# Altium schematic sheet S7CAS-PLEIADES-CARTE-MERE_P06_ADC.SchDoc
size Tabloid; SheetNumber: 16; SheetTotal: 18; Sheet_Name: ADC; Size: 11x17
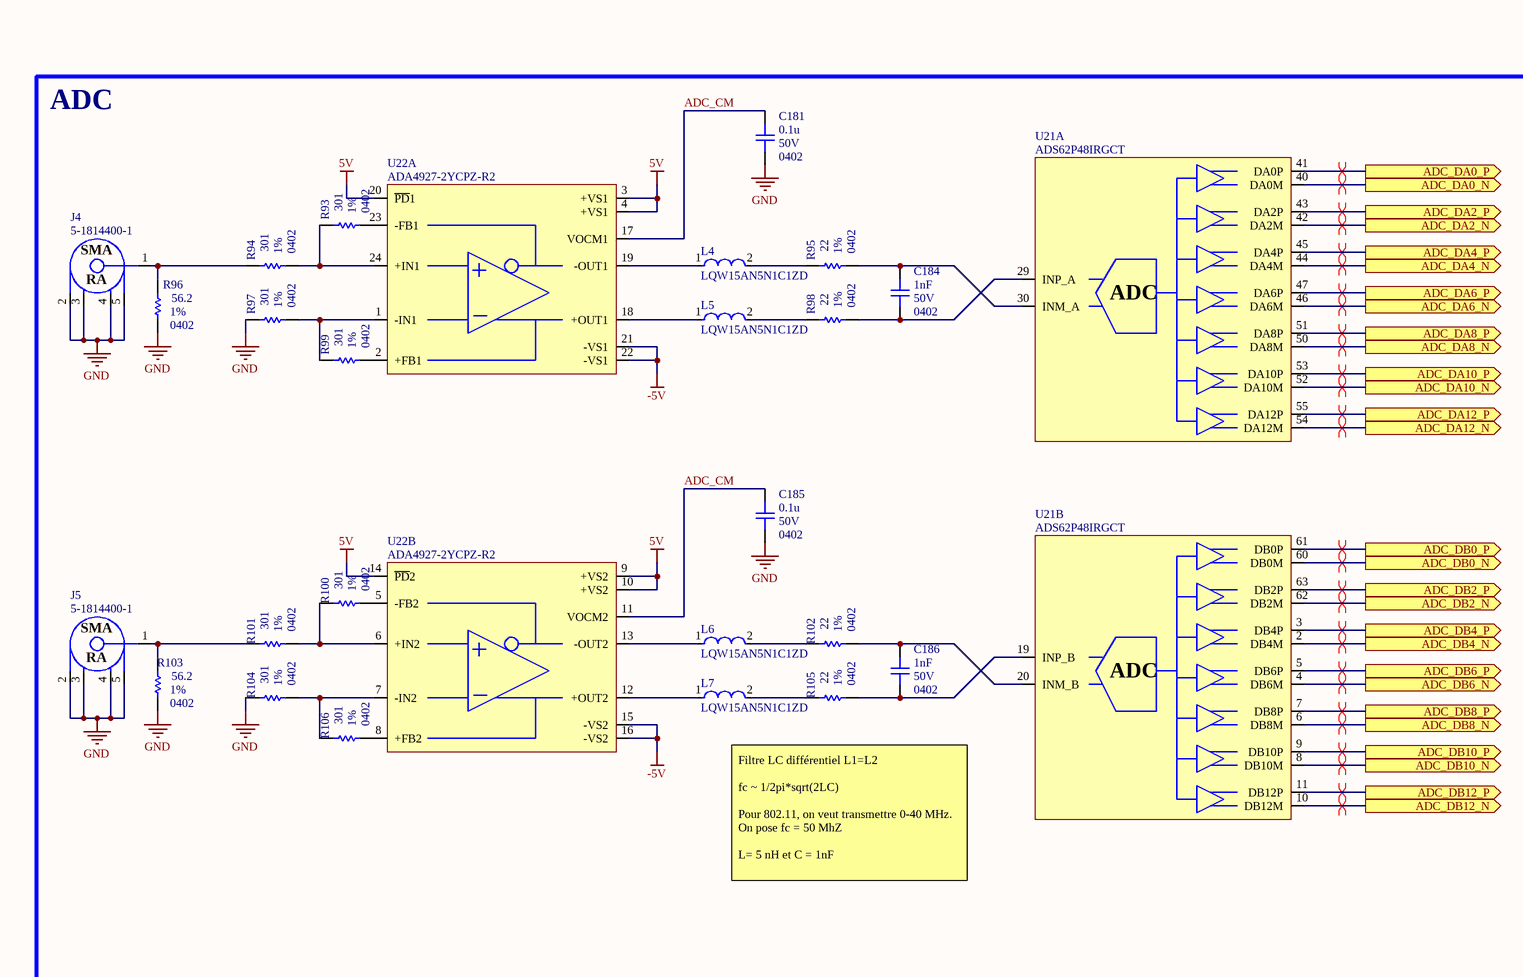
[diagram p0: S7CAS-PLEIADES-CARTE-MERE_P06_ADC.SchDoc, top left]
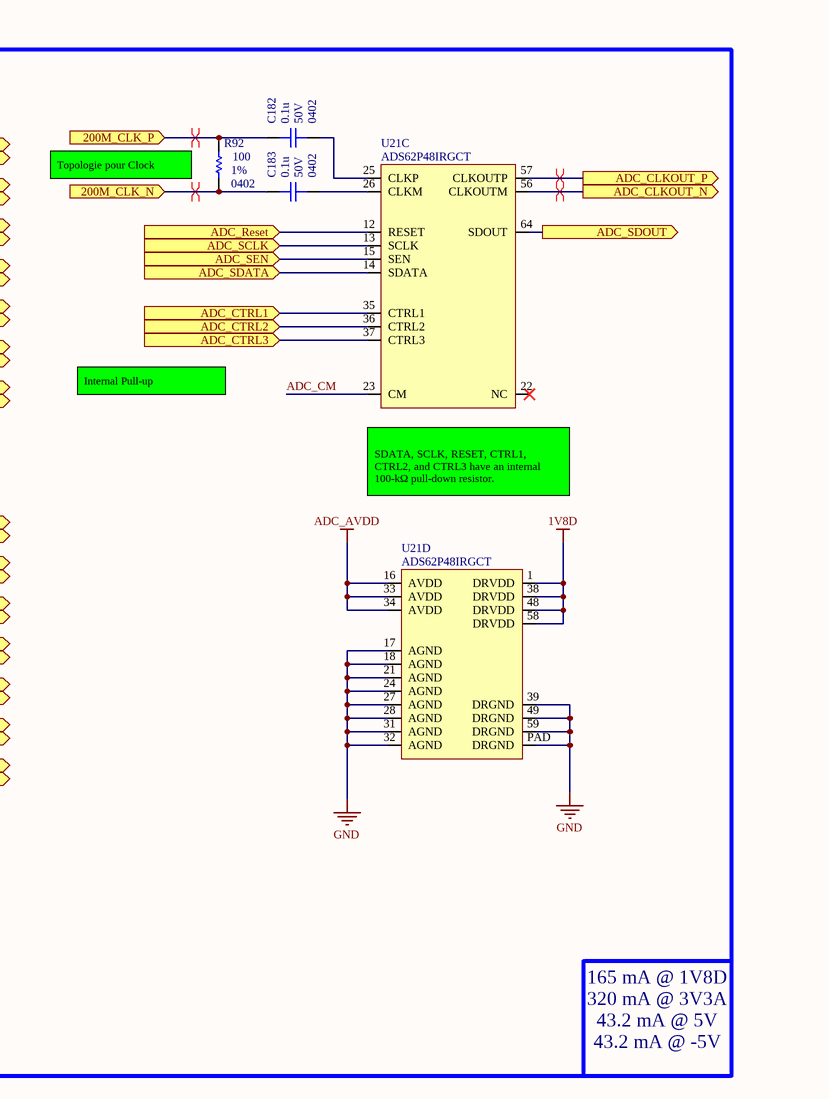
[diagram p1: S7CAS-PLEIADES-CARTE-MERE_P06_ADC.SchDoc, top middle]
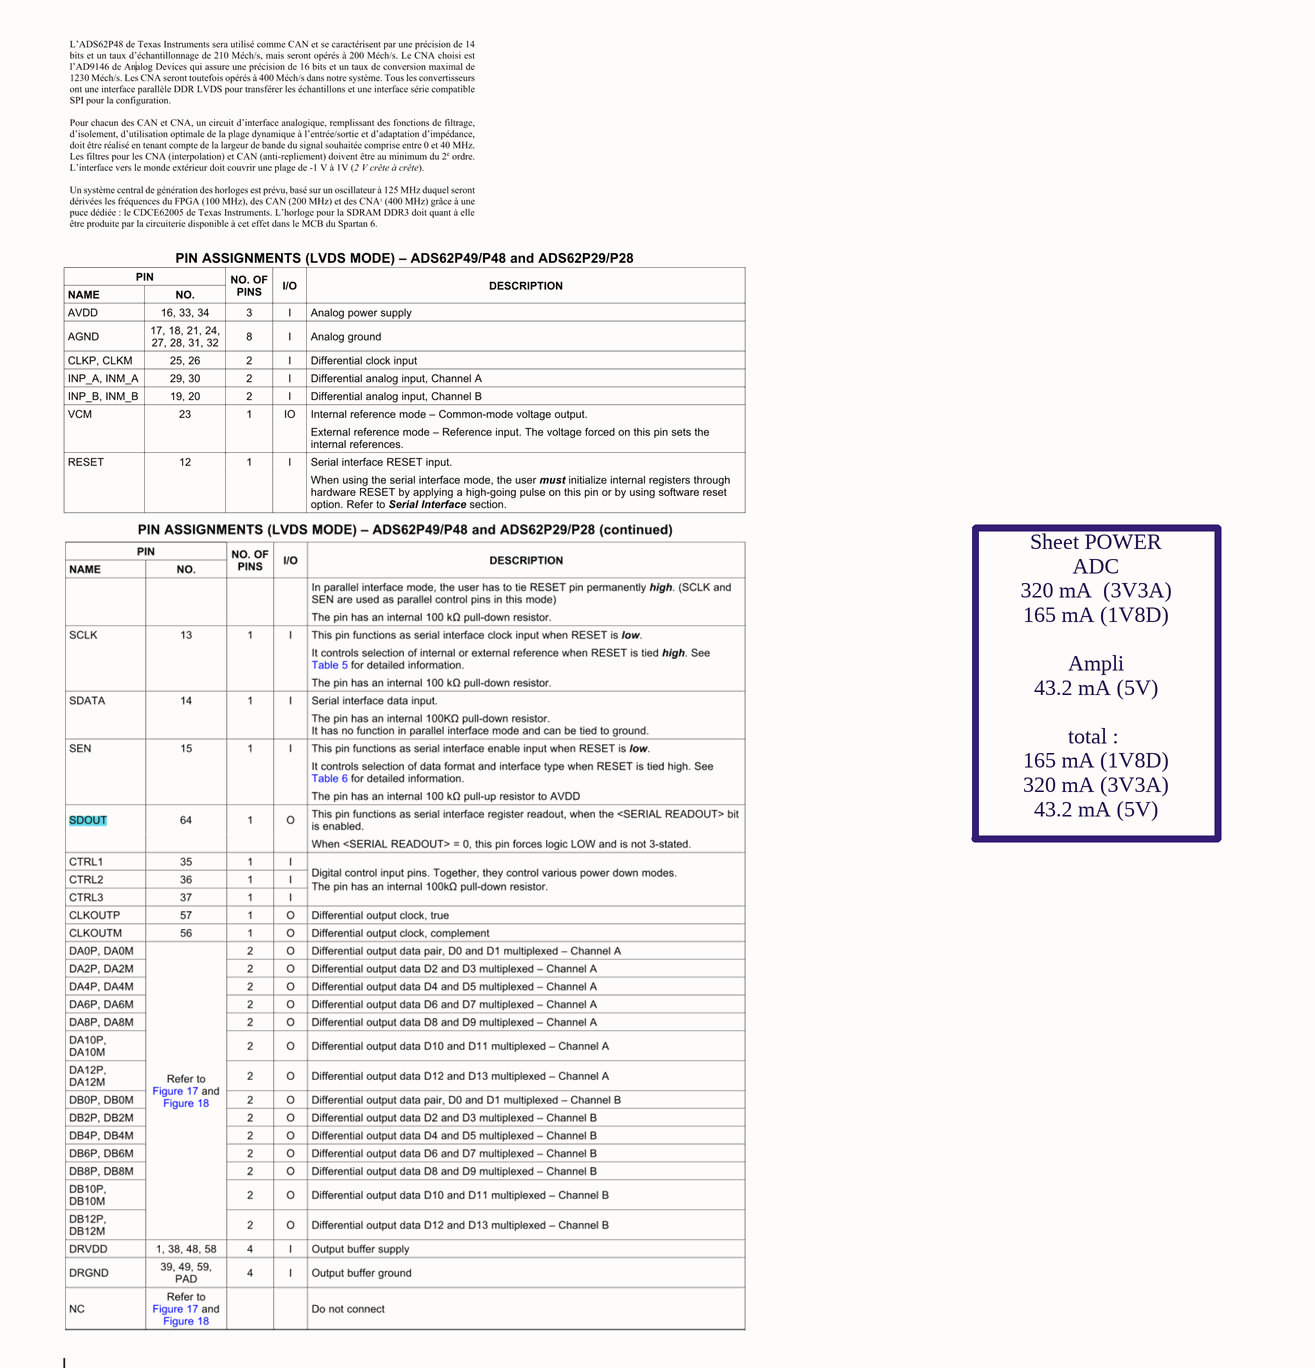
[diagram p2: S7CAS-PLEIADES-CARTE-MERE_P06_ADC.SchDoc, top right]
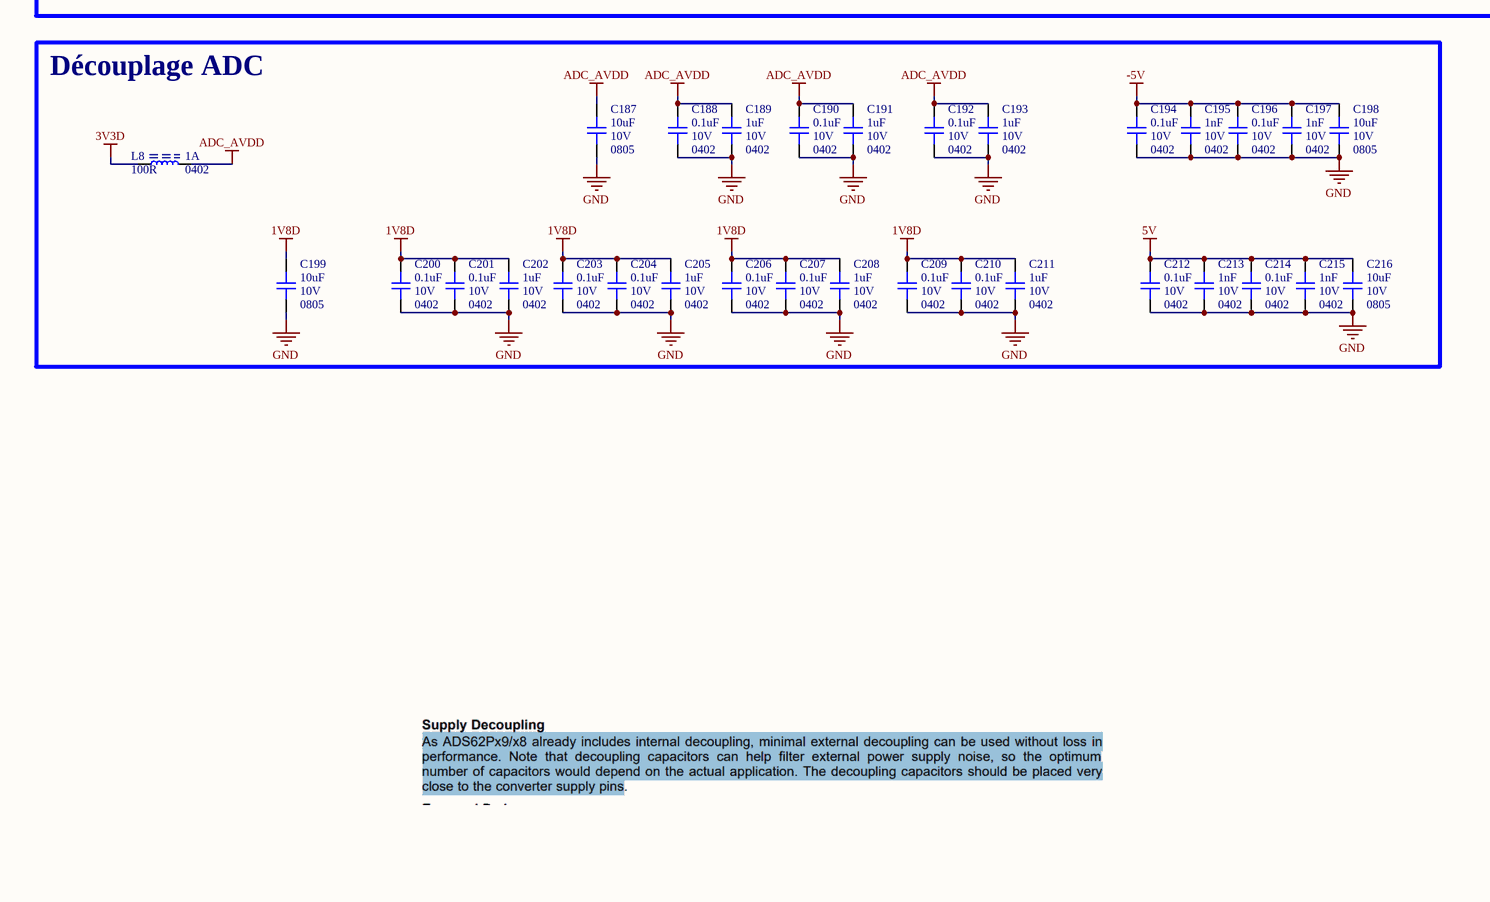
[diagram p3: S7CAS-PLEIADES-CARTE-MERE_P06_ADC.SchDoc, bottom left]
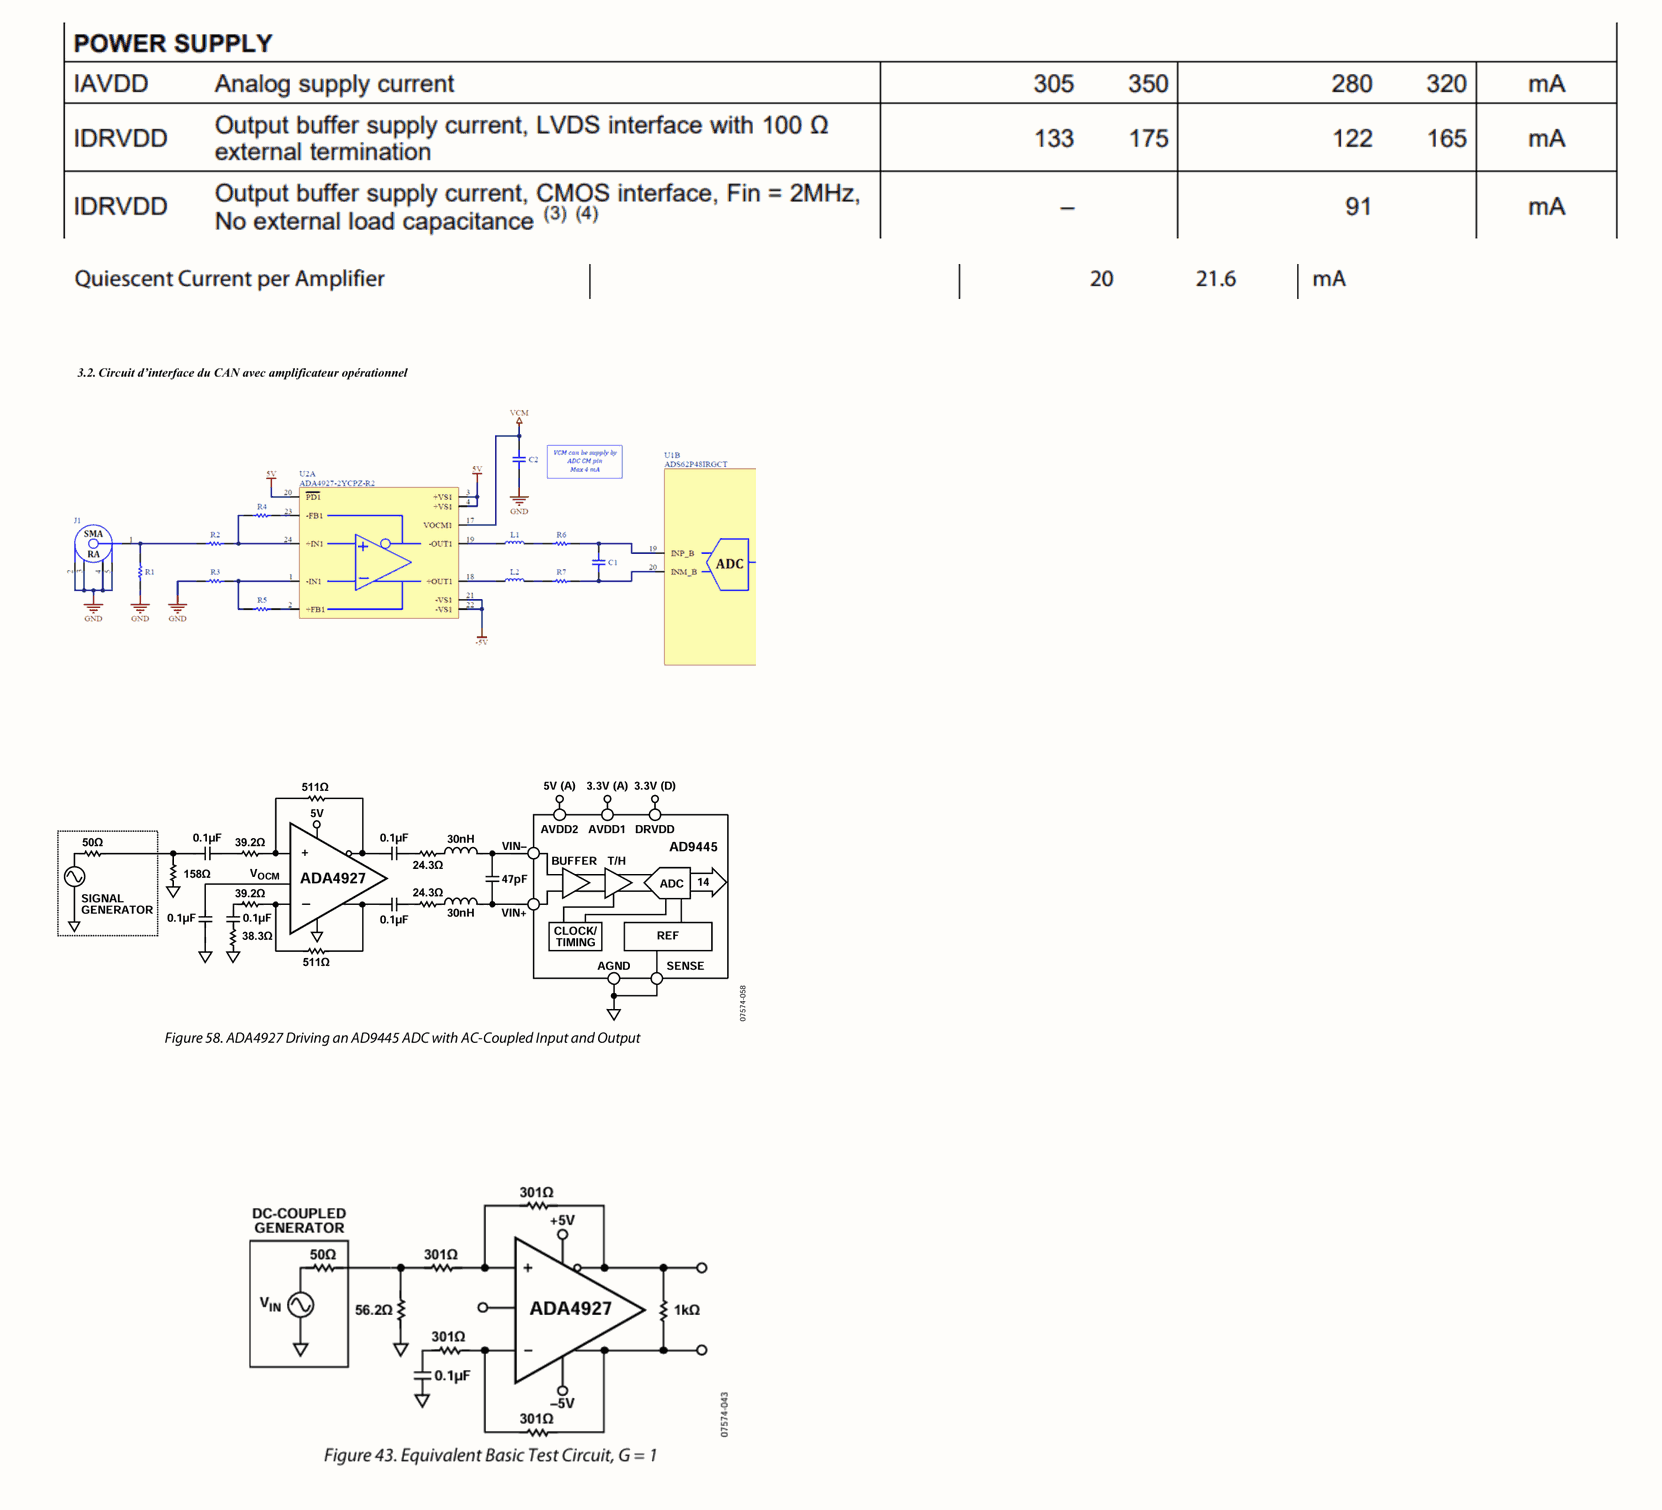
[diagram p4: S7CAS-PLEIADES-CARTE-MERE_P06_ADC.SchDoc, bottom right]

## Parts
C181  value 0.1u  Voltage: 50V  Package: 0402  [CAP_0402]  (hidden comment: CAP - 0402)
C182  value 0.1u  Voltage: 50V  Package: 0402  [CAP_0402]  (hidden comment: CAP - 0402)
C183  value 0.1u  Voltage: 50V  Package: 0402  [CAP_0402]  (hidden comment: CAP - 0402)
C184  value 1nF  Voltage: 50V  Package: 0402  [CAP_0402]  (hidden comment: CAP - 0402)
C185  value 0.1u  Voltage: 50V  Package: 0402  [CAP_0402]  (hidden comment: CAP - 0402)
C186  value 1nF  Voltage: 50V  Package: 0402  [CAP_0402]  (hidden comment: CAP - 0402)
C187  value 10uF  Voltage: 10V  Package: 0805  [CAP_0805]  (hidden comment: CAP - 0805)
C188  value 0.1uF  Voltage: 10V  Package: 0402  [CAP_0402]  (hidden comment: CAP - 0402)
C189  value 1uF  Voltage: 10V  Package: 0402  [CAP_0402]  (hidden comment: CAP - 0402)
C190  value 0.1uF  Voltage: 10V  Package: 0402  [CAP_0402]  (hidden comment: CAP - 0402)
C191  value 1uF  Voltage: 10V  Package: 0402  [CAP_0402]  (hidden comment: CAP - 0402)
C192  value 0.1uF  Voltage: 10V  Package: 0402  [CAP_0402]  (hidden comment: CAP - 0402)
C193  value 1uF  Voltage: 10V  Package: 0402  [CAP_0402]  (hidden comment: CAP - 0402)
C194  value 0.1uF  Voltage: 10V  Package: 0402  [CAP_0402]  (hidden comment: CAP - 0402)
C195  value 1nF  Voltage: 10V  Package: 0402  [CAP_0402]  (hidden comment: CAP - 0402)
C196  value 0.1uF  Voltage: 10V  Package: 0402  [CAP_0402]  (hidden comment: CAP - 0402)
C197  value 1nF  Voltage: 10V  Package: 0402  [CAP_0402]  (hidden comment: CAP - 0402)
C198  value 10uF  Voltage: 10V  Package: 0805  [CAP_0805]  (hidden comment: CAP - 0805)
C199  value 10uF  Voltage: 10V  Package: 0805  [CAP_0805]  (hidden comment: CAP - 0805)
C200  value 0.1uF  Voltage: 10V  Package: 0402  [CAP_0402]  (hidden comment: CAP - 0402)
C201  value 0.1uF  Voltage: 10V  Package: 0402  [CAP_0402]  (hidden comment: CAP - 0402)
C202  value 1uF  Voltage: 10V  Package: 0402  [CAP_0402]  (hidden comment: CAP - 0402)
C203  value 0.1uF  Voltage: 10V  Package: 0402  [CAP_0402]  (hidden comment: CAP - 0402)
C204  value 0.1uF  Voltage: 10V  Package: 0402  [CAP_0402]  (hidden comment: CAP - 0402)
C205  value 1uF  Voltage: 10V  Package: 0402  [CAP_0402]  (hidden comment: CAP - 0402)
C206  value 0.1uF  Voltage: 10V  Package: 0402  [CAP_0402]  (hidden comment: CAP - 0402)
C207  value 0.1uF  Voltage: 10V  Package: 0402  [CAP_0402]  (hidden comment: CAP - 0402)
C208  value 1uF  Voltage: 10V  Package: 0402  [CAP_0402]  (hidden comment: CAP - 0402)
C209  value 0.1uF  Voltage: 10V  Package: 0402  [CAP_0402]  (hidden comment: CAP - 0402)
C210  value 0.1uF  Voltage: 10V  Package: 0402  [CAP_0402]  (hidden comment: CAP - 0402)
C211  value 1uF  Voltage: 10V  Package: 0402  [CAP_0402]  (hidden comment: CAP - 0402)
C212  value 0.1uF  Voltage: 10V  Package: 0402  [CAP_0402]  (hidden comment: CAP - 0402)
C213  value 1nF  Voltage: 10V  Package: 0402  [CAP_0402]  (hidden comment: CAP - 0402)
C214  value 0.1uF  Voltage: 10V  Package: 0402  [CAP_0402]  (hidden comment: CAP - 0402)
C215  value 1nF  Voltage: 10V  Package: 0402  [CAP_0402]  (hidden comment: CAP - 0402)
C216  value 10uF  Voltage: 10V  Package: 0805  [CAP_0805]  (hidden comment: CAP - 0805)
J4  5-1814400-1  [CONN_SMA_5-1814400-1]
J5  5-1814400-1  [CONN_SMA_5-1814400-1]
L4  LQW15AN5N1C1ZD  [FP-LQW15AN_00-W0_6-0_1-MFG]
L5  LQW15AN5N1C1ZD  [FP-LQW15AN_00-W0_6-0_1-MFG]
L6  LQW15AN5N1C1ZD  [FP-LQW15AN_00-W0_6-0_1-MFG]
L7  LQW15AN5N1C1ZD  [FP-LQW15AN_00-W0_6-0_1-MFG]
L8  value 100R  Current: 1A  Package: 0402  [FER_0402]  (hidden comment: FER - 0402)
R92  value 100  Package: 0402  Precision: 1%  [RES_0402]  (hidden comment: RES - 0402)
R93  value 301  Package: 0402  Precision: 1%  [RES_0402]  (hidden comment: RES - 0402)
R94  value 301  Package: 0402  Precision: 1%  [RES_0402]  (hidden comment: RES - 0402)
R95  value 22  Package: 0402  Precision: 1%  [RES_0402]  (hidden comment: RES - 0402)
R96  value 56.2  Package: 0402  Precision: 1%  [RES_0402]  (hidden comment: RES - 0402)
R97  value 301  Package: 0402  Precision: 1%  [RES_0402]  (hidden comment: RES - 0402)
R98  value 22  Package: 0402  Precision: 1%  [RES_0402]  (hidden comment: RES - 0402)
R99  value 301  Package: 0402  Precision: 1%  [RES_0402]  (hidden comment: RES - 0402)
R100  value 301  Package: 0402  Precision: 1%  [RES_0402]  (hidden comment: RES - 0402)
R101  value 301  Package: 0402  Precision: 1%  [RES_0402]  (hidden comment: RES - 0402)
R102  value 22  Package: 0402  Precision: 1%  [RES_0402]  (hidden comment: RES - 0402)
R103  value 56.2  Package: 0402  Precision: 1%  [RES_0402]  (hidden comment: RES - 0402)
R104  value 301  Package: 0402  Precision: 1%  [RES_0402]  (hidden comment: RES - 0402)
R105  value 22  Package: 0402  Precision: 1%  [RES_0402]  (hidden comment: RES - 0402)
R106  value 301  Package: 0402  Precision: 1%  [RES_0402]  (hidden comment: RES - 0402)
U21  ADS62P48IRGCT  [ADC_ADS62P48IRGCT]  (parts A,B,C,D of 4)
U22  ADA4927-2YCPZ-R2  [OPAMP_ADA4927-2YCPZ-R2]  (parts A,B of 2)

## Blocks framed on the sheet
ADC: C181-C186 J4 J5 L4-L7 R92-R106 U21 U22
Découplage ADC: C187-C216 L8

## Ports
200M_CLK_N (in, see S7CAS-PLEIADES-CARTE-MERE_P06_CLOCK[4A]), 200M_CLK_P (in, see S7CAS-PLEIADES-CARTE-MERE_P06_CLOCK[4A]), ADC_CLKOUT_N (out, see S7CAS-PLEIADES-CARTE-MERE_P06_FPGA1[4B]), ADC_CLKOUT_P (out, see S7CAS-PLEIADES-CARTE-MERE_P06_FPGA1[4B]), ADC_CTRL1 (in, see S7CAS-PLEIADES-CARTE-MERE_P06_FPGA3[4B]), ADC_CTRL2 (in, see S7CAS-PLEIADES-CARTE-MERE_P06_FPGA3[4B]), ADC_CTRL3 (in, see S7CAS-PLEIADES-CARTE-MERE_P06_FPGA3[4B]), ADC_DA0_N (out, see S7CAS-PLEIADES-CARTE-MERE_P06_FPGA1[6A]), ADC_DA0_P (out, see S7CAS-PLEIADES-CARTE-MERE_P06_FPGA1[6A]), ADC_DA2_N (out, see S7CAS-PLEIADES-CARTE-MERE_P06_FPGA1[6A]), ADC_DA2_P (out, see S7CAS-PLEIADES-CARTE-MERE_P06_FPGA1[6A]), ADC_DA4_N (out, see S7CAS-PLEIADES-CARTE-MERE_P06_FPGA1[6A]), ADC_DA4_P (out, see S7CAS-PLEIADES-CARTE-MERE_P06_FPGA1[6A]), ADC_DA6_N (out, see S7CAS-PLEIADES-CARTE-MERE_P06_FPGA1[6A]), ADC_DA6_P (out, see S7CAS-PLEIADES-CARTE-MERE_P06_FPGA1[6A]), ADC_DA8_N (out, see S7CAS-PLEIADES-CARTE-MERE_P06_FPGA1[6B]), ADC_DA8_P (out, see S7CAS-PLEIADES-CARTE-MERE_P06_FPGA1[6B]), ADC_DA10_N (out, see S7CAS-PLEIADES-CARTE-MERE_P06_FPGA1[6B]), ADC_DA10_P (out, see S7CAS-PLEIADES-CARTE-MERE_P06_FPGA1[6B]), ADC_DA12_N (out, see S7CAS-PLEIADES-CARTE-MERE_P06_FPGA1[6B]), ADC_DA12_P (out, see S7CAS-PLEIADES-CARTE-MERE_P06_FPGA1[6B]), ADC_DB0_N (out, see S7CAS-PLEIADES-CARTE-MERE_P06_FPGA1[6B]), ADC_DB0_P (out, see S7CAS-PLEIADES-CARTE-MERE_P06_FPGA1[6B]), ADC_DB2_N (out, see S7CAS-PLEIADES-CARTE-MERE_P06_FPGA1[6B]), ADC_DB2_P (out, see S7CAS-PLEIADES-CARTE-MERE_P06_FPGA1[6B]), ADC_DB4_N (out, see S7CAS-PLEIADES-CARTE-MERE_P06_FPGA1[6B]), ADC_DB4_P (out, see S7CAS-PLEIADES-CARTE-MERE_P06_FPGA1[6B]), ADC_DB6_N (out, see S7CAS-PLEIADES-CARTE-MERE_P06_FPGA1[6B]), ADC_DB6_P (out, see S7CAS-PLEIADES-CARTE-MERE_P06_FPGA1[6B]), ADC_DB8_N (out, see S7CAS-PLEIADES-CARTE-MERE_P06_FPGA1[6B]), ADC_DB8_P (out, see S7CAS-PLEIADES-CARTE-MERE_P06_FPGA1[6B]), ADC_DB10_N (out, see S7CAS-PLEIADES-CARTE-MERE_P06_FPGA1[6B]), ADC_DB10_P (out, see S7CAS-PLEIADES-CARTE-MERE_P06_FPGA1[6B]), ADC_DB12_N (out, see S7CAS-PLEIADES-CARTE-MERE_P06_FPGA1[6B]), ADC_DB12_P (out, see S7CAS-PLEIADES-CARTE-MERE_P06_FPGA1[6B]), ADC_Reset (in, see S7CAS-PLEIADES-CARTE-MERE_P06_FPGA3[4A]), ADC_SCLK (in, see S7CAS-PLEIADES-CARTE-MERE_P06_FPGA3[4B]), ADC_SDATA (in, see S7CAS-PLEIADES-CARTE-MERE_P06_FPGA3[4B]), ADC_SDOUT (out, see S7CAS-PLEIADES-CARTE-MERE_P06_FPGA3[4B]), ADC_SEN (in, see S7CAS-PLEIADES-CARTE-MERE_P06_FPGA3[4B])

## Nets
1V8D: C199.2 C200.2 C201.2 C202.2 C203.2 C204.2 C205.2 C206.2 C207.2 C208.2 C209.2 C210.2 C211.2 U21.1(DRVDD) U21.38(DRVDD) U21.48(DRVDD) U21.58(DRVDD)
3V3D: L8.2
5V: C212.2 C213.2 C214.2 C215.2 C216.2 U22.3(+VS1) U22.4(+VS1) U22.9(+VS2) U22.10(+VS2) U22.14(~{PD}2) U22.20(~{PD}1)
-5V: C194.2 C195.2 C196.2 C197.2 C198.2 U22.15(-VS2) U22.16(-VS2) U22.21(-VS1) U22.22(-VS1)
ADC_AVDD: C187.2 C188.2 C189.2 C190.2 C191.2 C192.2 C193.2 L8.1 U21.16(AVDD) U21.33(AVDD) U21.34(AVDD)
GND: C181.1 C185.1 C187.1 C188.1 C189.1 C190.1 C191.1 C192.1 C193.1 C194.1 C195.1 C196.1 C197.1 C198.1 C199.1 C200.1 C201.1 C202.1 C203.1 C204.1 C205.1 C206.1 C207.1 C208.1 C209.1 C210.1 C211.1 C212.1 C213.1 C214.1 C215.1 C216.1 J4.2 J4.3 J4.4 J4.5 J5.2 J5.3 J5.4 J5.5 R96.1 R97.2 R103.1 R104.2 U21.17(AGND) U21.18(AGND) U21.21(AGND) U21.24(AGND) U21.27(AGND) U21.28(AGND) U21.31(AGND) U21.32(AGND) U21.39(DRGND) U21.49(DRGND) U21.59(DRGND) U21.PAD(DRGND)
200M_CLK_N: C183.2 R92.1 ; port 200M_CLK_N
200M_CLK_P: C182.2 R92.2 ; port 200M_CLK_P
ADC_CLKOUT_N: U21.56(CLKOUTM) ; port ADC_CLKOUT_N
ADC_CLKOUT_P: U21.57(CLKOUTP) ; port ADC_CLKOUT_P
ADC_CM: C181.2 C185.2 U21.23(CM) U22.11(VOCM2) U22.17(VOCM1)
ADC_CTRL1: U21.35(CTRL1) ; port ADC_CTRL1
ADC_CTRL2: U21.36(CTRL2) ; port ADC_CTRL2
ADC_CTRL3: U21.37(CTRL3) ; port ADC_CTRL3
ADC_DA0_N: U21.40(DA0M) ; port ADC_DA0_N
ADC_DA0_P: U21.41(DA0P) ; port ADC_DA0_P
ADC_DA2_N: U21.42(DA2M) ; port ADC_DA2_N
ADC_DA2_P: U21.43(DA2P) ; port ADC_DA2_P
ADC_DA4_N: U21.44(DA4M) ; port ADC_DA4_N
ADC_DA4_P: U21.45(DA4P) ; port ADC_DA4_P
ADC_DA6_N: U21.46(DA6M) ; port ADC_DA6_N
ADC_DA6_P: U21.47(DA6P) ; port ADC_DA6_P
ADC_DA8_N: U21.50(DA8M) ; port ADC_DA8_N
ADC_DA8_P: U21.51(DA8P) ; port ADC_DA8_P
ADC_DA10_N: U21.52(DA10M) ; port ADC_DA10_N
ADC_DA10_P: U21.53(DA10P) ; port ADC_DA10_P
ADC_DA12_N: U21.54(DA12M) ; port ADC_DA12_N
ADC_DA12_P: U21.55(DA12P) ; port ADC_DA12_P
ADC_DB0_N: U21.60(DB0M) ; port ADC_DB0_N
ADC_DB0_P: U21.61(DB0P) ; port ADC_DB0_P
ADC_DB2_N: U21.62(DB2M) ; port ADC_DB2_N
ADC_DB2_P: U21.63(DB2P) ; port ADC_DB2_P
ADC_DB4_N: U21.2(DB4M) ; port ADC_DB4_N
ADC_DB4_P: U21.3(DB4P) ; port ADC_DB4_P
ADC_DB6_N: U21.4(DB6M) ; port ADC_DB6_N
ADC_DB6_P: U21.5(DB6P) ; port ADC_DB6_P
ADC_DB8_N: U21.6(DB8M) ; port ADC_DB8_N
ADC_DB8_P: U21.7(DB8P) ; port ADC_DB8_P
ADC_DB10_N: U21.8(DB10M) ; port ADC_DB10_N
ADC_DB10_P: U21.9(DB10P) ; port ADC_DB10_P
ADC_DB12_N: U21.10(DB12M) ; port ADC_DB12_N
ADC_DB12_P: U21.11(DB12P) ; port ADC_DB12_P
ADC_Reset: U21.12(RESET) ; port ADC_Reset
ADC_SCLK: U21.13(SCLK) ; port ADC_SCLK
ADC_SDATA: U21.14(SDATA) ; port ADC_SDATA
ADC_SDOUT: U21.64(SDOUT) ; port ADC_SDOUT
ADC_SEN: U21.15(SEN) ; port ADC_SEN
NetC182_1: C182.1 U21.25(CLKP)
NetC183_1: C183.1 U21.26(CLKM)
NetC184_1: C184.1 R98.1 U21.29(INP_A)
NetC184_2: C184.2 R95.1 U21.30(INM_A)
NetC186_1: C186.1 R105.1 U21.19(INP_B)
NetC186_2: C186.2 R102.1 U21.20(INM_B)
NetJ4_1: J4.1 R94.2 R96.2
NetJ5_1: J5.1 R101.2 R103.2
NetL4_1: L4.1 U22.19(-OUT1)
NetL4_2: L4.2 R95.2
NetL5_1: L5.1 U22.18(+OUT1)
NetL5_2: L5.2 R98.2
NetL6_1: L6.1 U22.13(-OUT2)
NetL6_2: L6.2 R102.2
NetL7_1: L7.1 U22.12(+OUT2)
NetL7_2: L7.2 R105.2
NetR93_1: R93.1 U22.23(-FB1)
NetR93_2: R93.2 R94.1 U22.24(+IN1)
NetR97_1: R97.1 R99.2 U22.1(-IN1)
NetR99_1: R99.1 U22.2(+FB1)
NetR100_1: R100.1 U22.5(-FB2)
NetR100_2: R100.2 R101.1 U22.6(+IN2)
NetR104_1: R104.1 R106.2 U22.7(-IN2)
NetR106_1: R106.1 U22.8(+FB2)

Not connected (* = marked no-connect by the designer): U21 22(NC)*

## Layout directives
differential pair: 200M_CLK_N, 200M_CLK_P, ADC_CLKOUT_N, ADC_CLKOUT_P, ADC_DA0_N, ADC_DA0_P, ADC_DA2_N, ADC_DA2_P, ADC_DA4_N, ADC_DA4_P, ADC_DA6_N, ADC_DA6_P, ADC_DA8_N, ADC_DA8_P, ADC_DA10_N, ADC_DA10_P, ADC_DA12_N, ADC_DA12_P, ADC_DB0_N, ADC_DB0_P, ADC_DB2_N, ADC_DB2_P, ADC_DB4_N, ADC_DB4_P, ADC_DB6_N, ADC_DB6_P, ADC_DB8_N, ADC_DB8_P, ADC_DB10_N, ADC_DB10_P, ADC_DB12_N, ADC_DB12_P

## Notes on the sheet
- (near R92) Topologie pour Clock LVDS
- Internal Pull-up
- (near U21) SDATA, SCLK, RESET, CTRL1, CTRL2, and CTRL3 have an internal 100-kΩ pull-down resistor.
- Sheet POWER
  ADC
  320 mA  (3V3A)
  165 mA (1V8D)
  Ampli
  43.2 mA (5V)
  total :
  165 mA (1V8D)
  320 mA (3V3A)
  43.2 mA (5V)
- Filtre LC différentiel L1=L2
  fc ~ 1/2pi*sqrt(2LC)
  Pour 802.11, on veut transmettre 0-40 MHz. On pose fc = 50 MhZ
  L= 5 nH et C = 1nF
- 165 mA @ 1V8D
  320 mA @ 3V3A
  43.2 mA @ 5V
  43.2 mA @ -5V
- Sheet Name
- Project Title
- Global Project
- Size
- Group
- Revision
- Date
- Sheet
- of
- Filename
- Designers
- (in symbol ADC_ADS62P48IRGCT, part A) ADC
- (in symbol ADC_ADS62P48IRGCT, part B) ADC
- (in symbol CONN_SMA_5-1814400-1) SMA; RA

## Library data of the parts
C181-C183 C185 C188-C197 C200-C215 = CAP - 0402: Precision: 10%; Current: *; CreatedBy: Jonathan Bouchard; Power: *
C184 C186 = CAP - 0402: Mfg Part Number: GCM1555C1H102FA16D; Precision: 1%; Current: *; CreatedBy: Jonathan Bouchard; Power: *
C187 C198 C199 C216 = CAP - 0805: Precision: 10%; Current: *; CreatedBy: Jonathan Bouchard; Power: *
J4 J5 = CONN_SMA_5-1814400-1: CONN -  SMA JACK R/A 50 OHM - TH; Mfg: TE Connectivity AMP Connectors; Voltage: *; Current: *; Power: *; Mfg Part Number: 5-1814400-1; HelpURL: http://www.te.com/commerce/DocumentDelivery/DDEController?Action=srchrtrv&DocNm=1814400&DocType=Customer+Drawing&DocLang=English; CreatedBy: Jonathan Bouchard; Temperature: -55°C ~ 85°C; Value: *; Precision: *; Package: TH-5; Supplier 1: Digikey; Supplier Part Number 1: A97593-ND
L4-L7 = CMP-06042-006317-1: Wire Wound RF Inductor for Automotive 5.1nH ±0.2nH 800mA 0.051Ω 0402 (1005)
R92-R106 = RES - 0402: Voltage: 50V; Power: 1/16W; Current: *; CreatedBy: Jonathan Bouchard
U21 = ADC_ADS62P48IRGCT: ADC - 14 BIT 210MSPS SUAL - VQFN-64; Voltage: 3.15 V ~ 3.6 V / 1.7 V ~ 1.9 V; Mfg: Texas Instruments; Precision: 14 Bit; Current: *; Power: *; Mfg Part Number: ADS62P48IRGCT; HelpURL: http://www.ti.com/lit/ds/symlink/ads62p48.pdf; CreatedBy: Jonathan Bouchard; Temperature: -40°C ~ 85°C; Value: *; Package: VQFN-64; Supplier 1: Digikey; Supplier Part Number 1: 296-24611-1-ND
U22 = OPAMP_ADA4927-2YCPZ-R2: OPAMP - CFA 2.3GHZ - QFN-24; Voltage: 4.5 V ~ 11 V, ±2.25 V ~ 5.5 V; Current: 65mA; Mfg: Analog Devices; Power: *; Mfg Part Number: ADA4927-2YCPZ-R2; HelpURL: http://www.analog.com/media/en/technical-documentation/data-sheets/ADA4927-1_4927-2.pdf; CreatedBy: Jonathan Bouchard; Temperature: -40°C ~ 105°C; Value: *; Precision: *; Package: QFN-24; Supplier 1: Digikey; Supplier Part Number 1: ADA4927-2YCPZ-R2CT-ND
L8 = FER - 0402: Voltage: *; CreatedBy: Jonathan Bouchard; Power: *; Precision: *